# Altium schematic sheet Sch_TopLevel.SchDoc
size A4; CompanyName: Universidade Federal de Santa Maria; Organization: Universidade Federal de Santa Maria; Address1: Av. Roraima 1000; Address2: Camobi; Address3: Santa Maria - RS; Address4: Brasil; SheetNumber: 1; SheetTotal: 6
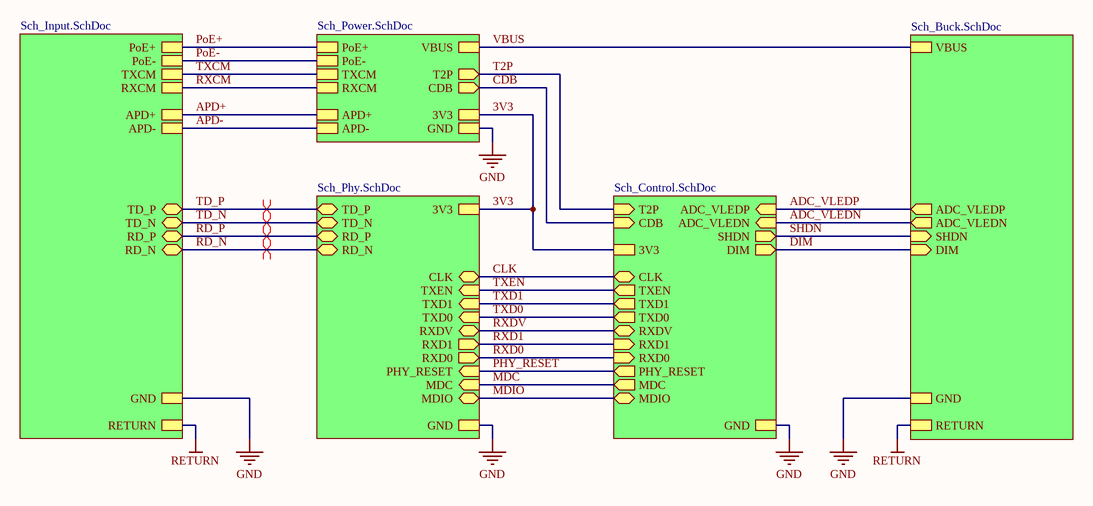
[diagram p0: Sch_TopLevel.SchDoc]

## Sub-sheets
Sheet0 = Sch_Input.SchDoc: PoE+, PoE-, TXCM, RXCM, APD-, APD+, TD_P (bidir), TD_N (bidir), RD_P (bidir), RD_N (bidir), GND, RETURN
Sheet1 = Sch_Power.SchDoc: VBUS, PoE-, PoE+, RXCM, TXCM, T2P (out), CDB (out), 3V3, GND, APD-, APD+
Sheet2 = Sch_Buck.SchDoc: VBUS, ADC_VLEDP (out), ADC_VLEDN (out), SHDN (in), DIM (in), GND, RETURN
Sheet3 = Sch_Phy.SchDoc: RXD1 (out), RXD0 (out), PHY_RESET (in), MDC (in), MDIO (bidir), TD_P (bidir), TD_N (bidir), RD_P (bidir), RD_N (bidir), 3V3, RXDV (bidir), TXD0 (in), TXD1 (in), TXEN (in), CLK (bidir), GND
Sheet4 = Sch_Control.SchDoc: 3V3, T2P (in), CDB (in), ADC_VLEDP (in), ADC_VLEDN (in), SHDN (out), DIM (out), CLK (bidir), RXD1 (in), RXD0 (in), PHY_RESET (out), MDC (out), MDIO (bidir), RXDV (bidir), TXD0 (out), TXD1 (out), TXEN (out), GND

## Nets
GND: sheet Sheet1/GND, sheet Sheet2/GND, sheet Sheet4/GND, sheet Sheet0/GND, sheet Sheet3/GND
RETURN: sheet Sheet2/RETURN, sheet Sheet0/RETURN
3V3: sheet Sheet1/3V3, sheet Sheet4/3V3, sheet Sheet3/3V3
ADC_VLEDN: sheet Sheet2/ADC_VLEDN, sheet Sheet4/ADC_VLEDN
ADC_VLEDP: sheet Sheet2/ADC_VLEDP, sheet Sheet4/ADC_VLEDP
APD+: sheet Sheet1/APD+, sheet Sheet0/APD+
APD-: sheet Sheet1/APD-, sheet Sheet0/APD-
CDB: sheet Sheet1/CDB, sheet Sheet4/CDB
CLK: sheet Sheet4/CLK, sheet Sheet3/CLK
DIM: sheet Sheet2/DIM, sheet Sheet4/DIM
MDC: sheet Sheet4/MDC, sheet Sheet3/MDC
MDIO: sheet Sheet4/MDIO, sheet Sheet3/MDIO
PHY_RESET: sheet Sheet4/PHY_RESET, sheet Sheet3/PHY_RESET
PoE+: sheet Sheet1/PoE+, sheet Sheet0/PoE+
PoE-: sheet Sheet1/PoE-, sheet Sheet0/PoE-
RD_N: sheet Sheet0/RD_N, sheet Sheet3/RD_N
RD_P: sheet Sheet0/RD_P, sheet Sheet3/RD_P
RXCM: sheet Sheet1/RXCM, sheet Sheet0/RXCM
RXD0: sheet Sheet4/RXD0, sheet Sheet3/RXD0
RXD1: sheet Sheet4/RXD1, sheet Sheet3/RXD1
RXDV: sheet Sheet4/RXDV, sheet Sheet3/RXDV
SHDN: sheet Sheet2/SHDN, sheet Sheet4/SHDN
T2P: sheet Sheet1/T2P, sheet Sheet4/T2P
TD_N: sheet Sheet0/TD_N, sheet Sheet3/TD_N
TD_P: sheet Sheet0/TD_P, sheet Sheet3/TD_P
TXCM: sheet Sheet1/TXCM, sheet Sheet0/TXCM
TXD0: sheet Sheet4/TXD0, sheet Sheet3/TXD0
TXD1: sheet Sheet4/TXD1, sheet Sheet3/TXD1
TXEN: sheet Sheet4/TXEN, sheet Sheet3/TXEN
VBUS: sheet Sheet1/VBUS, sheet Sheet2/VBUS

## Layout directives
differential pair: RD_N, RD_P, TD_N, TD_P

## Notes on the sheet
- Engineers
- Title
- Size:
- Date:
- A4
- Number:
- Time:
- Revision:
- Sheet
- of
- File: